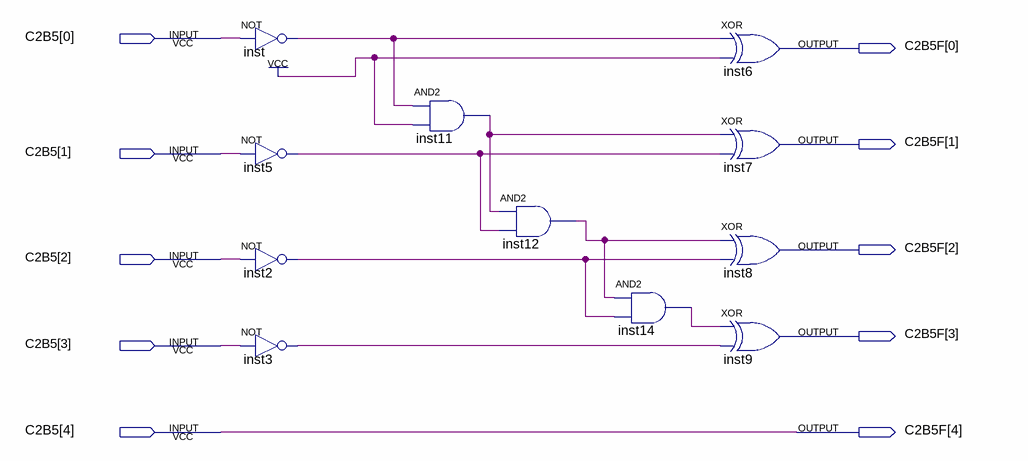
[diagram p0: schematic sheet]
// Quartus schematic CincoBitsComplemento2.bdf as structural Verilog: 11 symbols, 10 pins
module CincoBitsComplemento2 (
  input  [4:0] C2B5,
  output [4:0] C2B5F
);

  wire inst2_out, inst3_out, inst5_out, inst11_out, inst12_out, inst14_out, inst_out;

  not inst (inst_out, C2B5[0]);
  not inst5 (inst5_out, C2B5[1]);
  not inst2 (inst2_out, C2B5[2]);
  not inst3 (inst3_out, C2B5[3]);
  and inst11 (inst11_out, inst_out, 1'b1);
  and inst12 (inst12_out, inst11_out, inst5_out);
  and inst14 (inst14_out, inst12_out, inst2_out);
  xor inst6 (C2B5F[0], inst_out, 1'b1);
  xor inst7 (C2B5F[1], inst11_out, inst5_out);
  xor inst8 (C2B5F[2], inst12_out, inst2_out);
  xor inst9 (C2B5F[3], inst14_out, inst3_out);

  assign C2B5F[4] = C2B5[4];
endmodule
